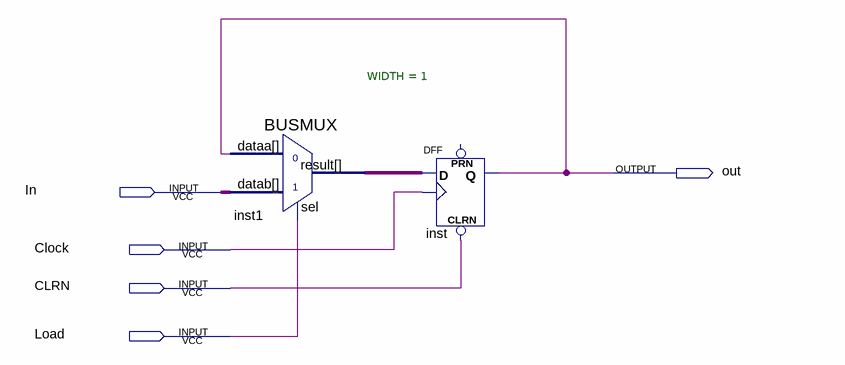
[diagram p0: schematic sheet]
// Quartus schematic register.bdf as structural Verilog: 2 symbols, 5 pins
module register (
  input  In,
  input  Clock,
  input  CLRN,
  input  Load,
  output out
);

  wire inst1_result;

  BUSMUX #(.WIDTH(1)) inst1 (.datab(In), .sel(Load), .dataa(out), .result(inst1_result));
  DFF inst (.CLRN(CLRN), .CLK(Clock), .D(inst1_result), .Q(out));  // open: PRN
endmodule
